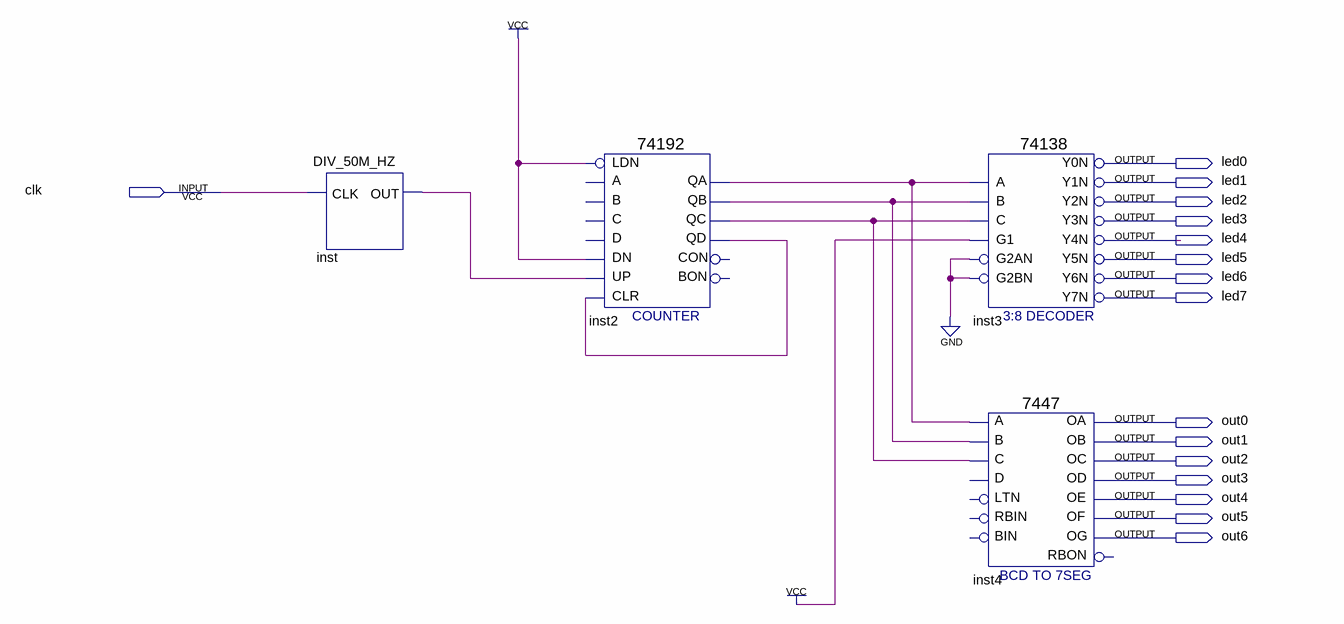
[diagram p0: schematic sheet]
// Quartus schematic Block1.bdf as structural Verilog: 4 symbols, 16 pins
module Block1 (
  input  clk,
  output led0,
  output led1,
  output led2,
  output led3,
  output led4,
  output led5,
  output led6,
  output led7,
  output out0,
  output out1,
  output out2,
  output out3,
  output out4,
  output out5,
  output out6
);

  wire inst2_qa, inst2_qb, inst2_qc, inst2_qd, inst_out;

  DIV_50M_HZ inst (.CLK(clk), .OUT(inst_out));
  \74192  inst2 (
    .CLR(inst2_qd), .UP(inst_out), .DN(1'b1), .LDN(1'b1), .QB(inst2_qb), .QA(inst2_qa), .QC(inst2_qc),
    .QD(inst2_qd));  // open: D, C, A, B, BON, CON
  \74138  inst3 (
    .A(inst2_qa), .B(inst2_qb), .G1(1'b1), .C(inst2_qc), .G2AN(1'b0), .G2BN(1'b0), .Y0N(led0), .Y1N(led1),
    .Y2N(led2), .Y3N(led3), .Y4N(led4), .Y5N(led5), .Y6N(led6), .Y7N(led7));
  \7447  inst4 (
    .B(inst2_qb), .C(inst2_qc), .A(inst2_qa), .OB(out1), .OC(out2), .OE(out4), .OD(out3), .OF(out5),
    .OG(out6), .OA(out0));  // open: LTN, D, RBIN, BIN, RBON
endmodule
